# EAGLE design rov_shield (EAGLE 9.6.2)
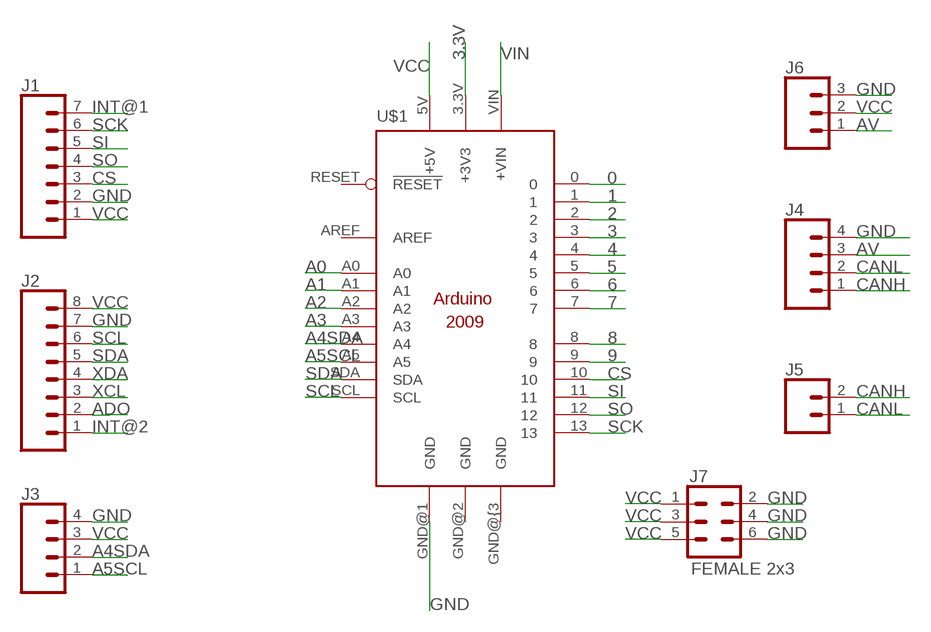
[diagram p0: schematic, sheet 1]

## Parts
J1  CONN_07  [1X07]
J2  CONN_08"  [1X08]
J3  CONN_04  [1X04]
J4  CONN_04  [1X04]
J5  CONN_02  [1X02]
J6  CONN_03  [1X03]
J7  FEMALE 2x3  CONN_03X2FEMALE  [2X3]
U$1  ELYAPıMıUNO  [ELYAPıNıMUNO]

## Nets
0: U$1.0
1: U$1.1
2: U$1.2
3: U$1.3
3.3V: U$1.3.3V(+3V3)
4: U$1.4
5: U$1.5
6: U$1.6
7: U$1.7
8: U$1.8
9: U$1.9
A0: U$1.A0
A1: U$1.A1
A2: U$1.A2
A3: U$1.A3
A4SDA: J3.2 U$1.A4
A5SCL: J3.1 U$1.A5
ADO: J2.2
AV: J4.3 J6.1
CANH: J4.1 J5.2
CANL: J4.2 J5.1
CS: J1.3 U$1.10
GND: J1.2 J2.7 J3.4 J4.4 J6.3 J7.2 J7.4 J7.6 U$1.GND@1(GND)
INT@1: J1.7
INT@2: J2.1
SCK: J1.6 U$1.13
SCL: J2.6 U$1.SCL
SDA: J2.5 U$1.SDA
SI: J1.5 U$1.11
SO: J1.4 U$1.12
VCC: J1.1 J2.8 J3.3 J6.2 J7.1 J7.3 J7.5 U$1.5V(+5V)
VIN: U$1.VIN(+VIN)
XCL: J2.3
XDA: J2.4
Unconnected: U$1.AREF U$1.RESET(!RESET)

## Power pins joined to a net without a drawn wire
GND: U$1.GND@2(GND) U$1.GND@{3(GND)

## Library data of the parts
J1 = SparkFun-Connectors:CONN_07: Multi connection point. Often used as Generic Header-pin footprint for 0.1 inch spaced/style header connections On any of the 0.1 inch spaced packages, you can populate with these: Break Away Headers - Straight <https://www.sparkfun.com/products/116> (PRT-00116) Break Away Male Headers - Right Angle <https://www.sparkfun.com/products/553> (PRT-00553) Female Headers <https://www.sparkfun.com/products/115> (PRT-00115) Break Away Headers - Machine Pin <https://www.sparkfun.com/products/117> (PRT-00117) Break Away Female Headers - Swiss Machine Pin <https://www.sparkfun.com/products/743> (PRT-00743) For SCREWTERMINALS and SPRING TERMINALS visit here: Screw Terimnals on SparkFun.com <https://www.sparkfun.com/search/results?term=Screw+Terminals> (5mm/3.5mm/2.54mm spacing) This device is also useful as a general connection point to wire up your design to another part of your project. Our various solder wires solder well into these plated through hole pads. Hook-Up Wire - Assortment (Stranded, 22 AWG) <https://www.sparkfun.com/products/11375> (PRT-11375) Hook-Up Wire - Assortment (Solid Core, 22 AWG) <https://www.sparkfun.com/products/11367> (PRT-11367) View the entire wire category on our website here <https://www.sparkfun.com/categories/141> Special notes: Molex polarized connector foot print use with SKU : PRT-08231 with associated crimp pins and housings. 1MM SMD Version SKU: PRT-10208 NOTES ON THE VARIANTS LOCK and LOCK_LONGPADS... This footprint was designed to help hold the alignment of a through-hole component (i.e. 6-pin header) while soldering it into place. You may notice that each hole has been shifted either up or down by 0.005 of an inch from it's more standard position (which is a perfectly straight line). This slight alteration caused the pins (the squares in the middle) to touch the edges of the holes. Because they are alternating, it causes a "brace" to hold the component in place. 0.005 has proven to be the perfect amount of "off-center" position when using our standard breakaway headers. Although looks a little odd when you look at the bare footprint, once you have a header in there, the alteration is very hard to notice. Also,if you push a header all the way into place, it is covered up entirely on the bottom side.
J2 = SparkFun-Connectors:CONN_08: Multi connection point. Often used as Generic Header-pin footprint for 0.1 inch spaced/style header connections On any of the 0.1 inch spaced packages, you can populate with these: Break Away Headers - Straight <https://www.sparkfun.com/products/116> (PRT-00116) Break Away Male Headers - Right Angle <https://www.sparkfun.com/products/553> (PRT-00553) Female Headers <https://www.sparkfun.com/products/115> (PRT-00115) Break Away Headers - Machine Pin <https://www.sparkfun.com/products/117> (PRT-00117) Break Away Female Headers - Swiss Machine Pin <https://www.sparkfun.com/products/743> (PRT-00743) Arduino Stackable Header - 8 Pin <https://www.sparkfun.com/products/9279> (PRT-09279) For SCREWTERMINALS and SPRING TERMINALS visit here: Screw Terimnals on SparkFun.com <https://www.sparkfun.com/search/results?term=Screw+Terminals> (5mm/3.5mm/2.54mm spacing) This device is also useful as a general connection point to wire up your design to another part of your project. Our various solder wires solder well into these plated through hole pads. Hook-Up Wire - Assortment (Stranded, 22 AWG) <https://www.sparkfun.com/products/11375> (PRT-11375) Hook-Up Wire - Assortment (Solid Core, 22 AWG) <https://www.sparkfun.com/products/11367> (PRT-11367) View the entire wire category on our website here <https://www.sparkfun.com/categories/141> Special notes: Molex polarized connector foot print use with SKU : PRT-08231 with associated crimp pins and housings. 1MM SMD Version SKU: PRT-10208 NOTES ON THE VARIANTS LOCK and LOCK_LONGPADS... This footprint was designed to help hold the alignment of a through-hole component (i.e. 6-pin header) while soldering it into place. You may notice that each hole has been shifted either up or down by 0.005 of an inch from it's more standard position (which is a perfectly straight line). This slight alteration caused the pins (the squares in the middle) to touch the edges of the holes. Because they are alternating, it causes a "brace" to hold the component in place. 0.005 has proven to be the perfect amount of "off-center" position when using our standard breakaway headers. Although looks a little odd when you look at the bare footprint, once you have a header in there, the alteration is very hard to notice. Also,if you push a header all the way into place, it is covered up entirely on the bottom side.; PROD_ID: CONN-08438
J3 J4 = SparkFun-Connectors:CONN_04: Multi connection point. Often used as Generic Header-pin footprint for 0.1 inch spaced/style header connections On any of the 0.1 inch spaced packages, you can populate with these: Break Away Headers - Straight <https://www.sparkfun.com/products/116> (PRT-00116) Break Away Male Headers - Right Angle <https://www.sparkfun.com/products/553> (PRT-00553) Female Headers <https://www.sparkfun.com/products/115> (PRT-00115) Break Away Headers - Machine Pin <https://www.sparkfun.com/products/117> (PRT-00117) Break Away Female Headers - Swiss Machine Pin <https://www.sparkfun.com/products/743> (PRT-00743) For SCREWTERMINALS and SPRING TERMINALS visit here: Screw Terimnals on SparkFun.com <https://www.sparkfun.com/search/results?term=Screw+Terminals> (5mm/3.5mm/2.54mm spacing) This device is also useful as a general connection point to wire up your design to another part of your project. Our various solder wires solder well into these plated through hole pads. Hook-Up Wire - Assortment (Stranded, 22 AWG) <https://www.sparkfun.com/products/11375> (PRT-11375) Hook-Up Wire - Assortment (Solid Core, 22 AWG) <https://www.sparkfun.com/products/11367> (PRT-11367) View the entire wire category on our website here <https://www.sparkfun.com/categories/141> Special notes: Molex polarized connector foot print use with SKU : PRT-08231 with associated crimp pins and housings. 1MM SMD Version SKU: PRT-10208; PROD_ID: CONN-09696
J5 = SparkFun-Connectors:CONN_02: Multi connection point. Often used as Generic Header-pin footprint for 0.1 inch spaced/style header connections On any of the 0.1 inch spaced packages, you can populate with these: Break Away Headers - Straight <https://www.sparkfun.com/products/116> (PRT-00116) Break Away Male Headers - Right Angle <https://www.sparkfun.com/products/553> (PRT-00553) Female Headers <https://www.sparkfun.com/products/115> (PRT-00115) Break Away Headers - Machine Pin <https://www.sparkfun.com/products/117> (PRT-00117) Break Away Female Headers - Swiss Machine Pin <https://www.sparkfun.com/products/743> (PRT-00743) For SCREWTERMINALS and SPRING TERMINALS visit here: Screw Terimnals on SparkFun.com <https://www.sparkfun.com/search/results?term=Screw+Terminals> (5mm/3.5mm/2.54mm spacing) This device is also useful as a general connection point to wire up your design to another part of your project. Our various solder wires solder well into these plated through hole pads. Hook-Up Wire - Assortment (Stranded, 22 AWG) <https://www.sparkfun.com/products/11375> (PRT-11375) Hook-Up Wire - Assortment (Solid Core, 22 AWG) <https://www.sparkfun.com/products/11367> (PRT-11367) View the entire wire category on our website here <https://www.sparkfun.com/categories/141> Special notes: Molex polarized connector foot print use with: PRT-08233 with associated crimp pins and housings. 2.54_SCREWTERM for use with PRT-10571. 3.5mm Screw Terminal footprints for PRT-08084 5mm Screw Terminal footprints for use with PRT-08432
J6 = SparkFun-Connectors:CONN_03: Multi connection point. Often used as Generic Header-pin footprint for 0.1 inch spaced/style header connections On any of the 0.1 inch spaced packages, you can populate with these: Break Away Headers - Straight <https://www.sparkfun.com/products/116> (PRT-00116) Break Away Male Headers - Right Angle <https://www.sparkfun.com/products/553> (PRT-00553) Female Headers <https://www.sparkfun.com/products/115> (PRT-00115) Break Away Headers - Machine Pin <https://www.sparkfun.com/products/117> (PRT-00117) Break Away Female Headers - Swiss Machine Pin <https://www.sparkfun.com/products/743> (PRT-00743) Stackable Header - 3 Pin (Female, 0.1") <https://www.sparkfun.com/products/13875> (PRT-13875) For SCREWTERMINALS and SPRING TERMINALS visit here: Screw Terimnals on SparkFun.com <https://www.sparkfun.com/search/results?term=Screw+Terminals> (5mm/3.5mm/2.54mm spacing) This device is also useful as a general connection point to wire up your design to another part of your project. Our various solder wires solder well into these plated through hole pads. Hook-Up Wire - Assortment (Stranded, 22 AWG) <https://www.sparkfun.com/products/11375> (PRT-11375) Hook-Up Wire - Assortment (Solid Core, 22 AWG) <https://www.sparkfun.com/products/11367> (PRT-11367) View the entire wire category on our website here <https://www.sparkfun.com/categories/141> Special notes: Molex polarized connector foot print use with SKU : PRT-08232 with associated crimp pins and housings.
J7 = SparkFun-Connectors:CONN_03X2: Multi connection point. Often used as Generic Header-pin footprint for 0.1 inch spaced/style header connections You can populate with any combo of single row headers, but if you'd like an exact match, check these: Header - 2x3 (Male, 0.1") <https://www.sparkfun.com/products/12807> (PRT-12807) Header - 2x3 (Female, 0.1") <https://www.sparkfun.com/products/13010> (PRT-13010) 2x3 Pin Shrouded Header <https://www.sparkfun.com/products/10877> (PRT-10877) On any of the 0.1 inch spaced packages, you can populate with these: Break Away Headers - Straight <https://www.sparkfun.com/products/116> (PRT-00116) Break Away Male Headers - Right Angle <https://www.sparkfun.com/products/553> (PRT-00553) Female Headers <https://www.sparkfun.com/products/115> (PRT-00115) Break Away Headers - Machine Pin <https://www.sparkfun.com/products/117> (PRT-00117) Break Away Female Headers - Swiss Machine Pin <https://www.sparkfun.com/products/743> (PRT-00743) Special note: the shrouded connector mates well with our 3x2 ribbon cables: Ribbon Crimp Connector - 6-pin (2x3, Female) <https://www.sparkfun.com/products/10651> (PRT-10651) Ribbon Cable - 6 wire (15ft) <https://www.sparkfun.com/products/10646> (PRT-10646); PROD_ID: CONN-11566
U$1 = arduino (1):ELYAPıMıUNO

## Board
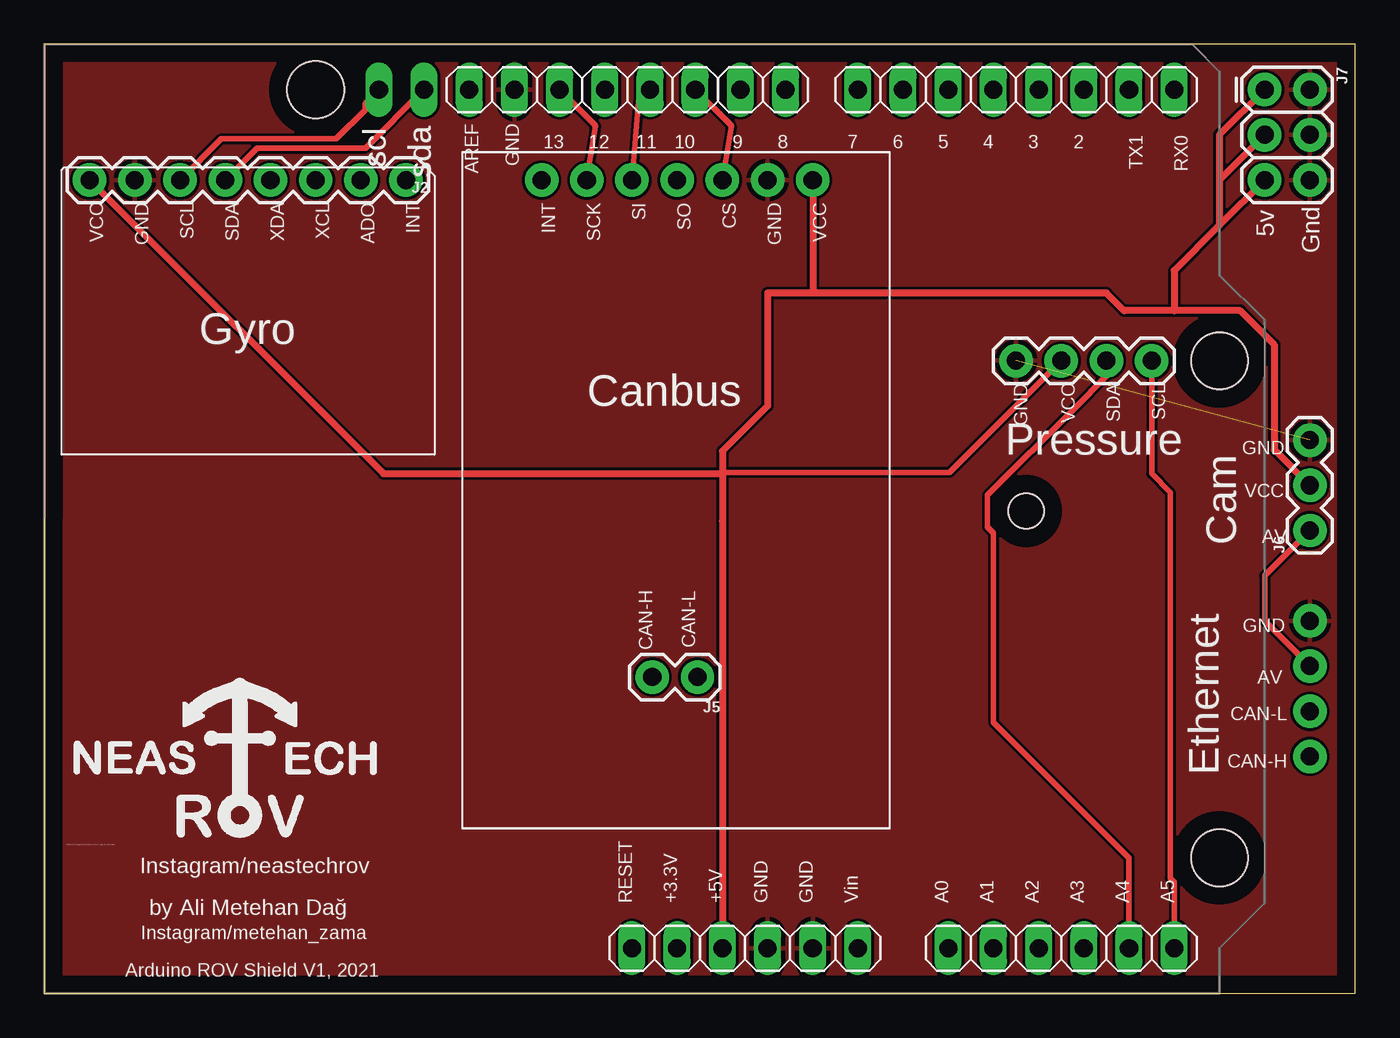
[diagram p1: board, top side]
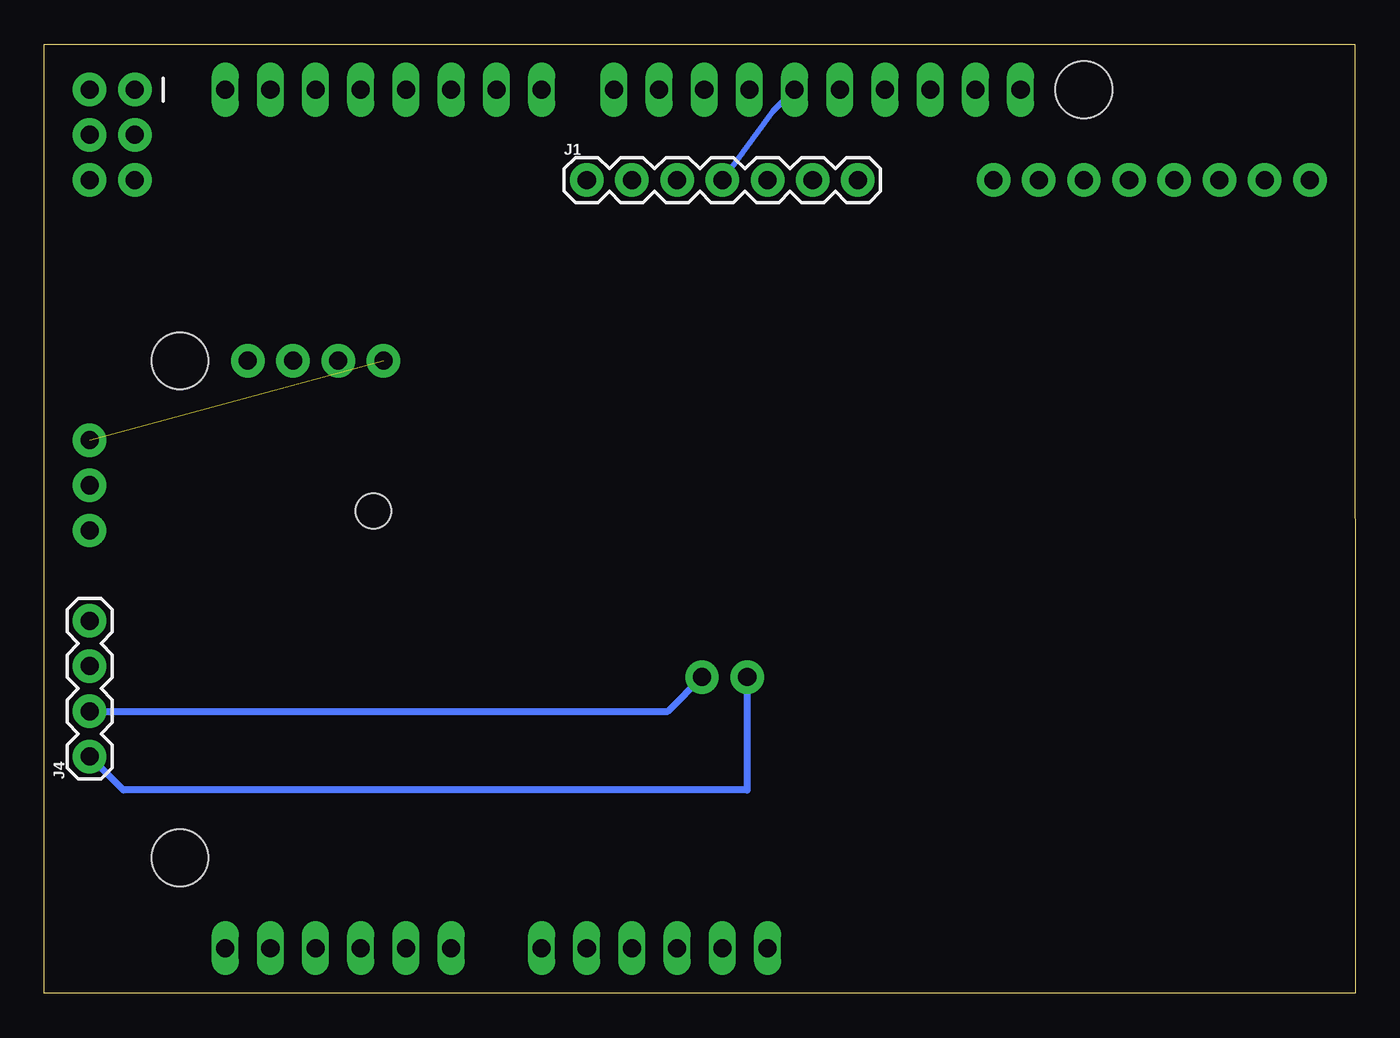
[diagram p2: board, bottom side, seen from below]

Size 73.66 x 53.34 mm. Coordinates in mm from the lower left corner, seen from the top.
Outline: 0,0 73.66,0 73.66,53.34 0,53.34 0,0
Copper layers (1*16): Top 0.035mm / dielectric 1.5mm / Bottom 0.035mm
Design rules "default": minimum track width 6mil, minimum drill 0.35mm, track to track 6mil, track to pad 6mil, pad to pad 6mil, via to via 6mil, smd to smd 6mil, copper to edge 40mil, drill to drill 6mil, minimum pad ring 10mil, minimum via ring 8mil, stop-mask expansion 4mil, vias tented up to drill 0mil, thermal gap 10mil

### Footprints (pad centres in the part's own frame; a part is rotated, then mirrored left to right if it is on the bottom)
1X07 = drill 1.016 pad 1.88: 1 0,0; 2 2.54,0; 3 5.08,0; 4 7.62,0; 5 10.16,0; 6 12.7,0; 7 15.24,0
1X08 = drill 1.016 pad 1.88: 1 0,0; 2 2.54,0; 3 5.08,0; 4 7.62,0; 5 10.16,0; 6 12.7,0; 7 15.24,0; 8 17.78,0
1X04 = drill 1.016 pad 1.88: 1 0,0; 2 2.54,0; 3 5.08,0; 4 7.62,0
1X02 = drill 1.016 pad 1.88: 1 0,0; 2 2.54,0
1X03 = drill 1.016 pad 1.88: 1 0,0; 2 2.54,0; 3 5.08,0
2X3 = drill 1.016 pad 1.88: 1 0,0; 2 0,2.54; 3 2.54,0; 4 2.54,2.54; 5 5.08,0; 6 5.08,2.54
ELYAPıNıMUNO = drill 1.016 long: 0 73.66,25.4; 1 71.12,25.4; 2 68.58,25.4; 3 66.04,25.4; 3.3V 45.72,-22.86; 4 63.5,25.4; 5 60.96,25.4; 5V 48.26,-22.86; 6 58.42,25.4; 7 55.88,25.4; 8 51.816,25.4; 9 49.276,25.4; 10 46.736,25.4; 11 44.196,25.4; 12 41.656,25.4; 13 39.116,25.4; A0 60.96,-22.86; A1 63.5,-22.86; A2 66.04,-22.86; A3 68.58,-22.86; A4 71.12,-22.86; A5 73.66,-22.86; AREF 34.036,25.4; GND@1 50.8,-22.86; GND@2 53.34,-22.86; GND@{3 36.576,25.4; RESET 43.18,-22.86; SCL 28.956,25.4; SDA 31.496,25.4; VIN 55.88,-22.86 | hole 3.2: 25.4,25.4; 76.2,10.16; 76.2,-17.78 | hole 2: 65.33,1.714

### Placement (x,y rotation side)
J1  43.18,45.72 0 bottom
J2  20.32,45.72 180 top
J3  62.23,35.56 180 top
J4  71.12,13.32 90 bottom
J5  36.7,17.78 180 top
J6  71.12,26.02 90 top
J7  68.58,50.8 270 top
U$1  -10.16,25.4 0 top

### Tracks (layer width: path | path; a pad name or v marks a point on that pad's centre or on a via)
A4SDA
  Top 0.305: J3.2 59.69,34.7 57.87,32.88 53,28.01 53,26.22 53.34,25.88 53.34,15.24 60.96,7.62 U$1.A4
A5SCL
  Top 0.305: U$1.A5 63.5,6.25 63.27,6.47 63.27,28.17 62.23,29.21 J3.1
AV
  Top 0.305: J6.1 68.58,23.48 68.58,20.94 J4.3
CANH
  Bottom 0.406: J4.1 69.23,11.43 34.16,11.43 J5.2
CANL
  Bottom 0.406: J4.2 38.62,15.86 J5.1
CS
  Top 0.305: U$1.10 38.6,48.77 J1.3
GND  (1 unrouted)
  Top 0.305: 26.67,50.55 U$1.GND@{3
  pour Top: -2.54,55.88 -2.54,-2.54 73.66,-2.54 73.66,55.88
SCK
  Top 0.305: U$1.13 30.98,48.77 J1.6
SCL
  Top 0.305: J2.6 9.93,48.03 16.39,48.03 18.01,49.65 18.01,50.01 U$1.SCL
SDA
  Top 0.305: J2.5 11.96,47.52 18.04,47.52 21.32,50.8 U$1.SDA
SI
  Top 0.305: U$1.11 33.4,50.16 J1.5
SO
  Bottom 0.305: J1.4 32.71,49.58 U$1.12
VCC
  Top 0.305: J3.3 50.88,29.29 38.1,29.29
  Top 0.406: 38.1,29.21 38.1,30.48 40.64,33.02 40.64,39.37 43.18,39.37 | 38.1,29.21 38.1,26.54 U$1.5V | 38.1,29.29 38.1,29.21 | 38.1,29.21 19.05,29.21 J2.8 | J6.2 69.12,30.56 69.12,36.47 67.21,38.38 63.5,38.38 | 63.5,38.38 60.68,38.38 59.69,39.37 43.18,39.37 | J1.1 43.18,39.37 | J7.5 66.04,43.18 | 66.04,43.18 63.5,40.64 63.5,38.38 | J7.3 66.04,45.72 | 66.04,45.72 66.04,43.18 | J7.1 66.04,48.26 66.04,45.72

### Text on the board
tPlace: C:/Users/Yenidogu/Pictures/Sualtı_Takım_Logo_bw_bmp.bmp
tNames: AREF | GND | 13 | 12 | 11 | 10 | 9 | 8 | 7 | 6 | 5 | 4 | 3 | 2 | TX1 | RX0 | VCC | GND | SCL | SDA | XDA | XCL | ADO | INT | INT | SCK | SI | SO | CS | GND | VCC | 5v | Gnd | Gyro | GND | VCC | SDA | SCL | Canbus | GND | Pressure | Cam | VCC | AV | GND | CAN-H | CAN-L | AV | CAN-L | CAN-H | Ethernet | Instagram/neastechrov | RESET | +3.3V | +5V | GND | GND | Vin | A0 | A1 | A2 | A3 | A4 | A5 | by Ali Metehan Dağ | Instagram/metehan_zama | Arduino ROV Shield V1, 2021